# EAGLE design explorer (EAGLE 7.5.0)
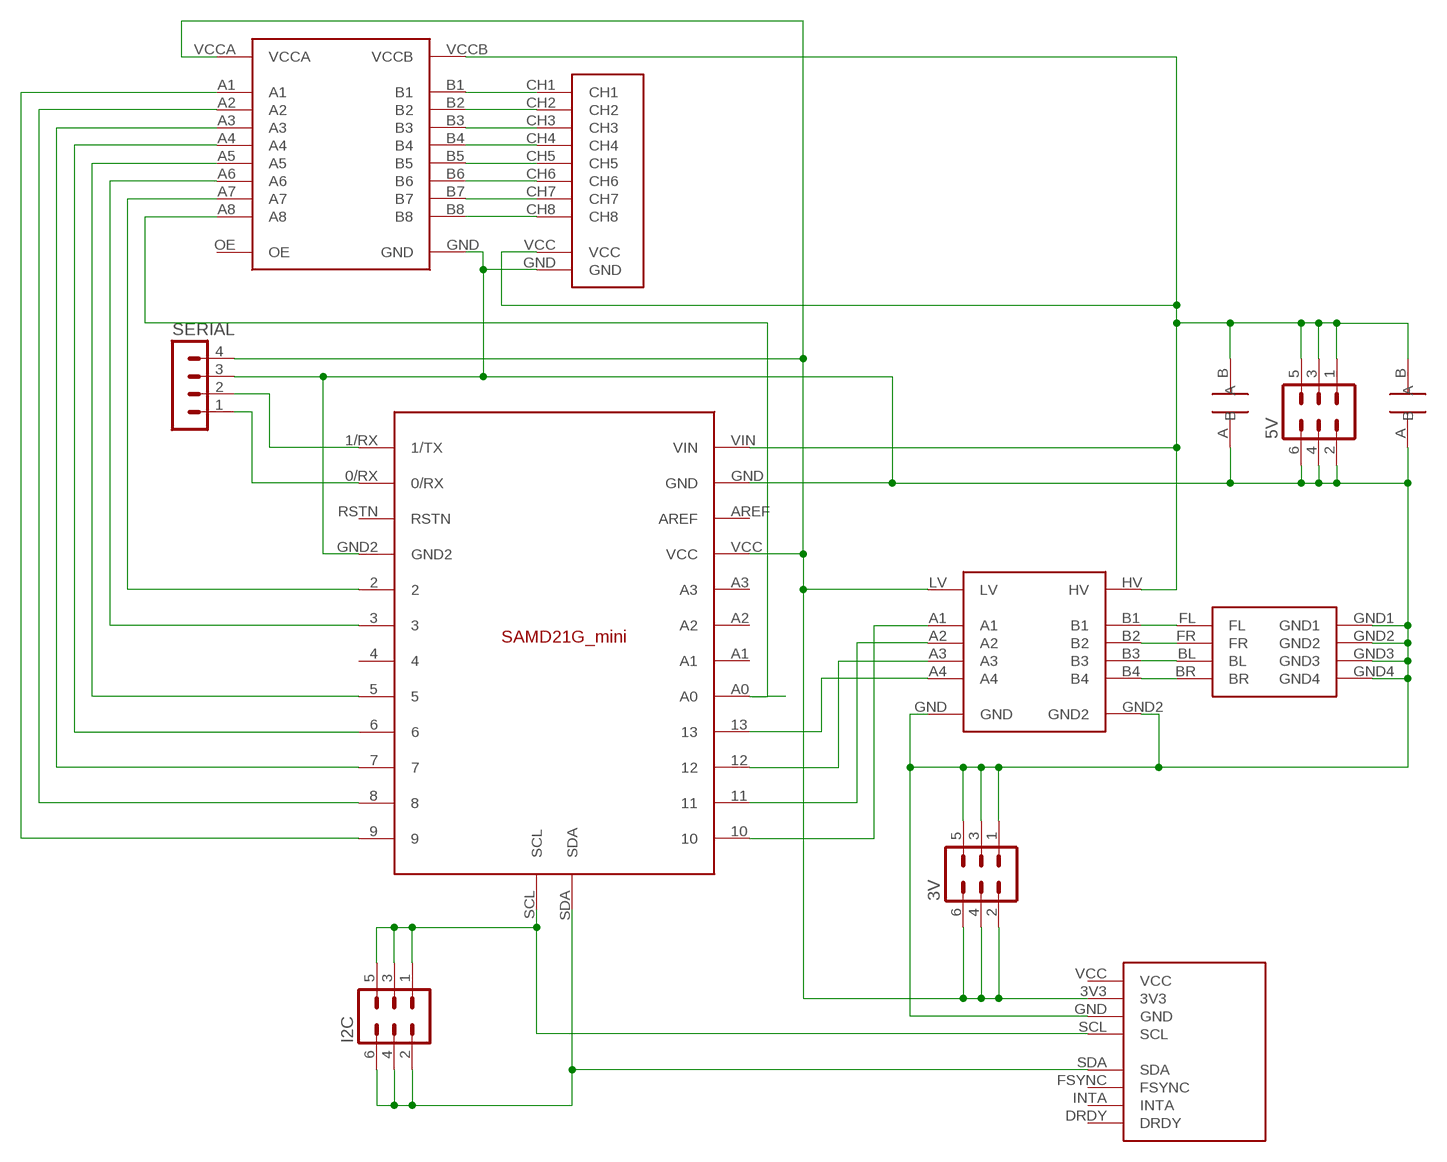
[diagram p0: schematic, sheet 1]

## Parts
3V  MA03-2  [MA03-2]
5V  MA03-2  [MA03-2]
I2C  MA03-2  [MA03-2]
SERIAL  MA04-1  [MA04-1]
U$1  MOTOR_HEADER  [MOTOR_HEADER]
U$2  CAP  [CAP]
U$3  SAMD21G_MINI  [SAMD21G-MINI]
U$4  LEVELSHIFT_8CH  [LEVELSHIFT_8CH]
U$5  LEVELSHIFT_4CH  [LEVELSHIFT_4CH]
U$6  RADIO_8CH  [RADIO_8CH]
U$7  CAP  [CAP]
U$8  GY-86  [GY-86]

## Nets
3V: 3V.2 3V.4 3V.6 SERIAL.4 U$3.VCC U$4.VCCA U$5.LV U$8.3V3
5V: 5V.1 5V.3 5V.5 U$2.B U$3.VIN U$4.VCCB U$5.HV U$6.VCC U$7.B
GND: 3V.1 3V.3 3V.5 5V.2 5V.4 5V.6 SERIAL.3 U$1.GND1 U$1.GND2 U$1.GND3 U$1.GND4 U$2.A U$3.GND U$3.GND2 U$4.GND U$5.GND U$5.GND2 U$6.GND U$7.A U$8.GND
N$1: U$1.BR U$5.B4
N$2: U$1.BL U$5.B3
N$3: U$1.FR U$5.B2
N$4: U$1.FL U$5.B1
N$6: U$3.7 U$4.A3
N$7: U$3.10 U$5.A1
N$8: U$3.11 U$5.A2
N$9: U$3.12 U$5.A3
N$10: U$3.13 U$5.A4
N$11: U$4.B1 U$6.CH1
N$12: U$4.B2 U$6.CH2
N$13: U$4.B3 U$6.CH3
N$14: U$4.B4 U$6.CH4
N$15: U$4.B5 U$6.CH5
N$16: U$4.B6 U$6.CH6
N$17: U$4.B7 U$6.CH7
N$18: U$4.B8 U$6.CH8
N$19: U$3.2 U$4.A7
N$20: U$3.9 U$4.A1
N$21: U$3.8 U$4.A2
N$22: U$3.6 U$4.A4
N$23: U$3.5 U$4.A5
N$24: U$3.3 U$4.A6
N$25: U$3.A0 U$4.A8
N$26: I2C.1 I2C.3 I2C.5 U$3.SCL U$8.SCL
N$28: I2C.2 I2C.4 I2C.6 U$3.SDA U$8.SDA
N$33: SERIAL.1 U$3.0/RX
N$34: SERIAL.2 U$3.1/RX(1/TX)
Unconnected: U$3.4 U$3.A1 U$3.A2 U$3.A3 U$3.AREF U$3.RSTN U$4.OE U$8.DRDY U$8.FSYNC U$8.INTA U$8.VCC

## Library data of the parts
3V 5V I2C = con-lstb:MA03-2: PIN HEADER; OC_FARNELL: unknown; OC_NEWARK: unknown
SERIAL = con-lstb:MA04-1: PIN HEADER; OC_FARNELL: unknown; OC_NEWARK: unknown
U$1 = quadcopter_comp:MOTOR_HEADER
U$2 U$7 = quadcopter_comp:CAP
U$3 = quadcopter_comp:SAMD21G_MINI
U$4 = quadcopter_comp:LEVELSHIFT_8CH
U$5 = quadcopter_comp:LEVELSHIFT_4CH
U$6 = quadcopter_comp:RADIO_8CH
U$8 = quadcopter_comp:GY-86: 10 DoF breakout board. Combined MPU6050, HMC5883L and MS5611

## Board
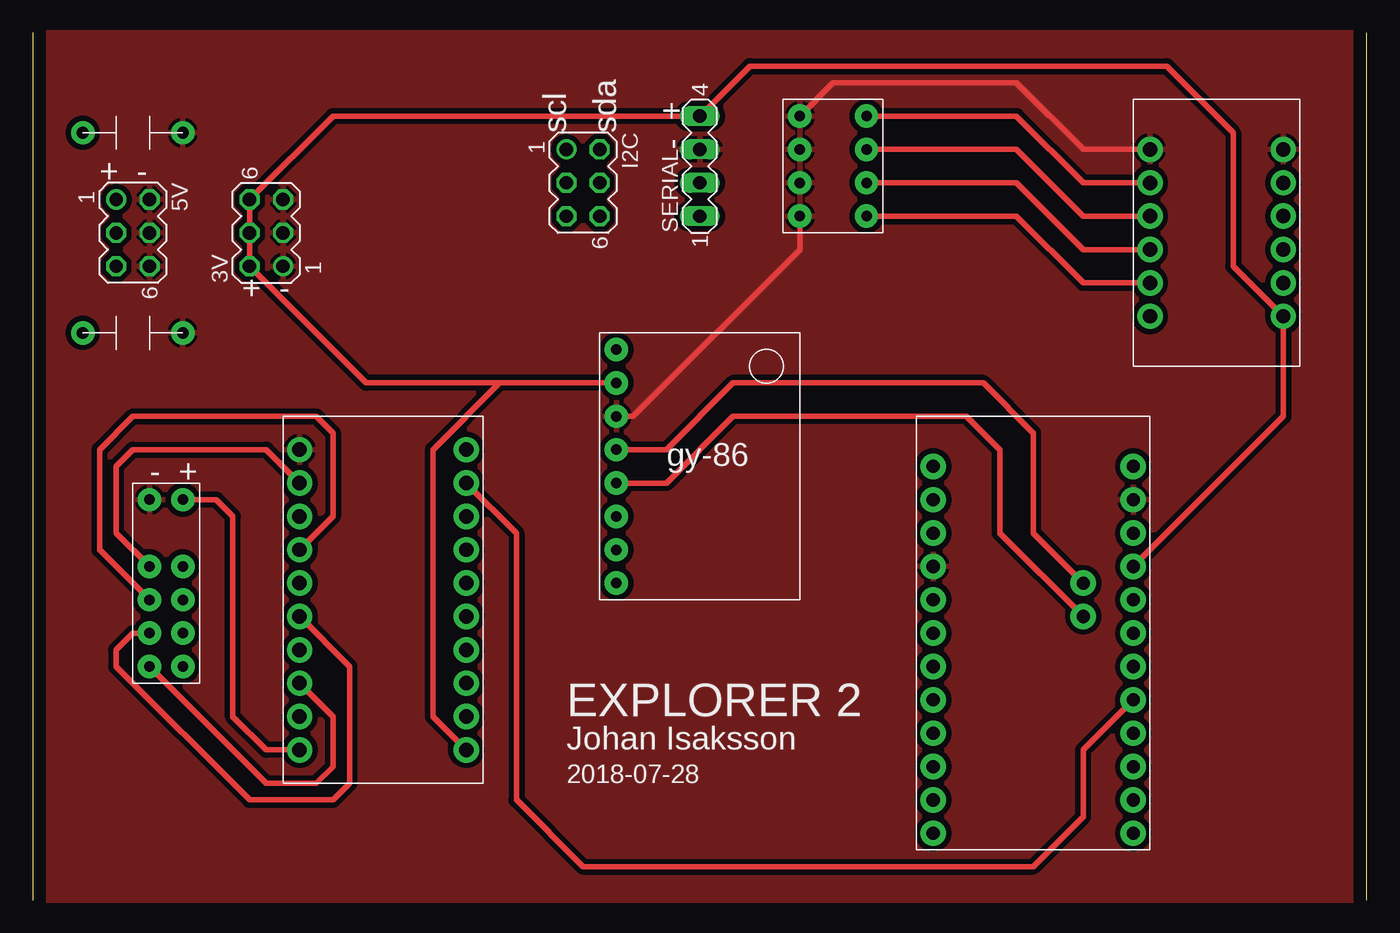
[diagram p1: board, top side]
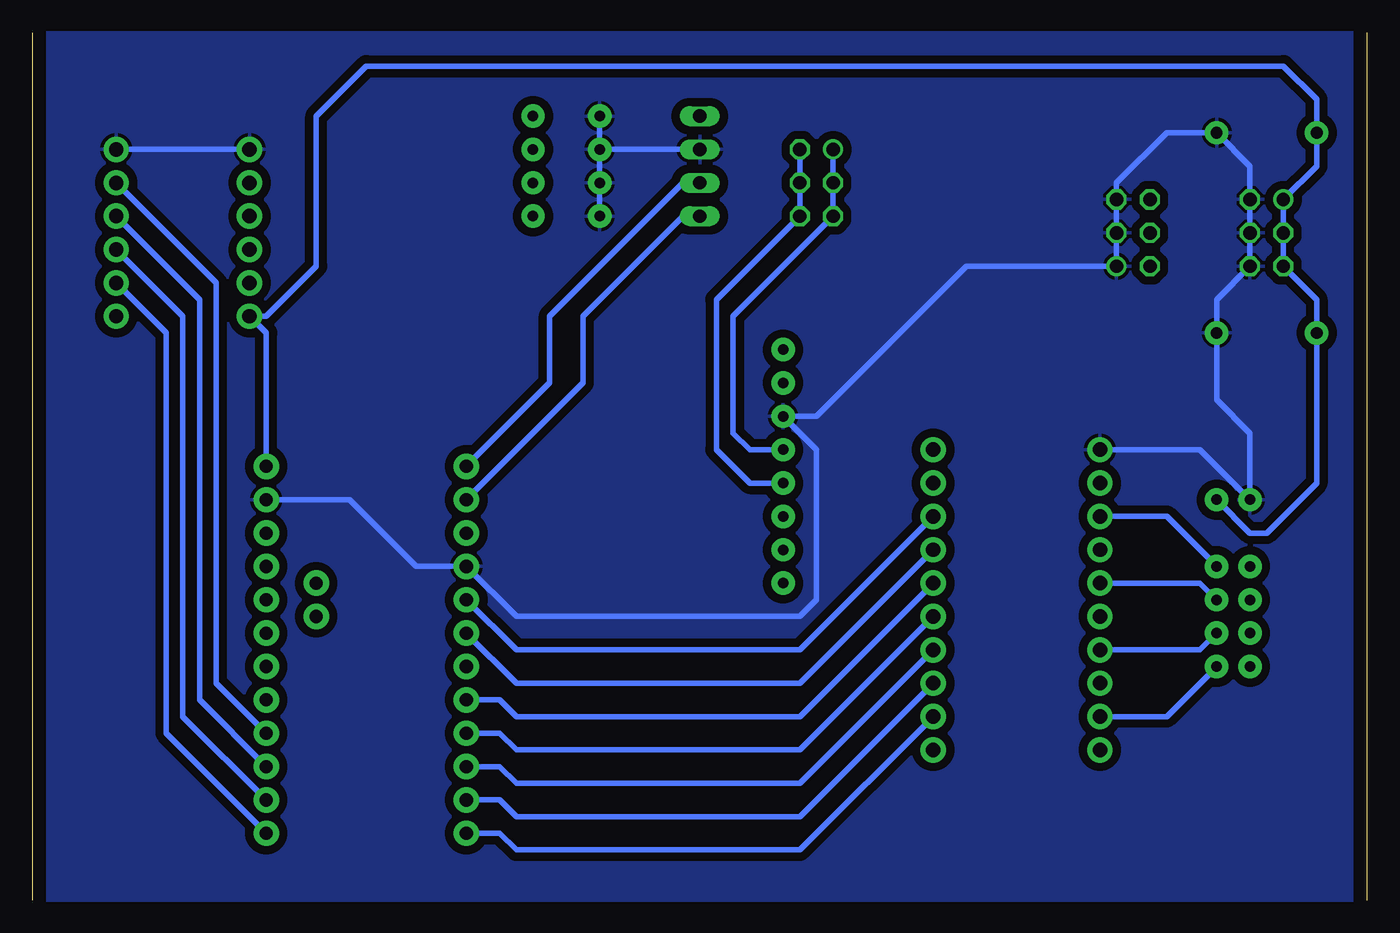
[diagram p2: board, bottom side, seen from below]

Size 101.6 x 66.03 mm. Coordinates in mm from the lower left corner, seen from the top.
Outline: 101.6,0 101.6,66.03
Outline: 0,66.03 0,0
Copper layers (1*16): Top 0.035mm / dielectric 1.5mm / Bottom 0.035mm
Design rules "default *": minimum track width 16mil, minimum drill 24mil, track to track 16mil, track to pad 16mil, pad to pad 16mil, via to via 16mil, smd to smd 8mil, copper to edge 40mil, drill to drill 8mil, minimum pad ring 10mil, minimum via ring 8mil, stop-mask expansion 4mil, vias tented up to drill 0mil, thermal gap 10mil

### Footprints (pad centres in the part's own frame; a part is rotated, then mirrored left to right if it is on the bottom)
MA03-2 = drill 1.016: 1 -2.54,-1.27 | drill 1.016 octagon: 2 -2.54,1.27; 3 0,-1.27; 4 0,1.27; 5 2.54,-1.27; 6 2.54,1.27
MA04-1 = drill 1.016 long: 1 -3.81,0; 2 -1.27,0; 3 1.27,0; 4 3.81,0
MOTOR_HEADER = drill 0.8 pad 1.778: BL -2.54,-1.27; BR -2.54,-3.81; FL -2.54,3.81; FR -2.54,1.27; GND1 2.54,3.81; GND2 2.54,1.27; GND3 2.54,-1.27; GND4 2.54,-3.81
CAP = drill 0.9 pad 1.778: A -3.81,0; B 3.81,0
SAMD21G-MINI = drill 1 pad 1.93: 0/RX -7.62,10.16; 1/RX -7.62,12.7; 2 -7.62,2.54; 3 -7.62,0; 4 -7.62,-2.54; 5 -7.62,-5.08; 6 -7.62,-7.62; 7 -7.62,-10.16; 8 -7.62,-12.7; 9 -7.62,-15.24; 10 7.62,-15.24; 11 7.62,-12.7; 12 7.62,-10.16; 13 7.62,-7.62; A0 7.62,-5.08; A1 7.62,-2.54; A2 7.62,0; A3 7.62,2.54; AREF 7.62,7.62; GND -7.62,5.08; GND2 7.62,10.16; RSTN -7.62,7.62; SCL 3.81,3.81; SDA 3.81,1.27; VCC 7.62,5.08; VIN 7.62,12.7
LEVELSHIFT_8CH = drill 1.1 pad 1.93: A1 -6.35,8.89; A2 -6.35,6.35; A3 -6.35,3.81; A4 -6.35,1.27; A5 -6.35,-1.27; A6 -6.35,-3.81; A7 -6.35,-6.35; A8 -6.35,-8.89; B1 6.35,8.89; B2 6.35,6.35; B3 6.35,3.81; B4 6.35,1.27; B5 6.35,-1.27; B6 6.35,-3.81; B7 6.35,-6.35; B8 6.35,-8.89; GND 6.35,-11.43; OE -6.35,-11.43; VCCA -6.35,11.43; VCCB 6.35,11.43
LEVELSHIFT_4CH = drill 1.1 pad 1.93: A1 -5.08,3.81; A2 -5.08,1.27; A3 -5.08,-1.27; A4 -5.08,-3.81; B1 5.08,3.81; B2 5.08,1.27; B3 5.08,-1.27; B4 5.08,-3.81; GND -5.08,-6.35; GND2 5.08,-6.35; HV 5.08,6.35; LV -5.08,6.35
RADIO_8CH = drill 0.8 pad 1.778: CH1 -1.27,6.35; CH2 1.27,6.35; CH3 -1.27,3.81; CH4 1.27,3.81; CH5 -1.27,1.27; CH6 1.27,1.27; CH7 -1.27,-1.27; CH8 1.27,-1.27; GND 1.27,-6.35; VCC -1.27,-6.35
GY-86 = drill 0.8 pad 1.778: 3V3 -6.35,6.35; DRDY -6.35,-8.89; FSYNC -6.35,-3.81; GND -6.35,3.81; INTA -6.35,-6.35; SCL -6.35,1.27; SDA -6.35,-1.27; VCC -6.35,8.89

### Placement (x,y rotation side)
3V  17.78,50.8 90 top
5V  7.62,50.8 270 top
I2C  41.91,54.61 270 top
SERIAL  50.8,55.88 90 top
U$1  60.96,55.88 180 top
U$2  7.62,43.18 180 top
U$3  76.2,20.32 0 top
U$4  26.67,22.86 180 top
U$5  90.17,50.8 180 top
U$6  10.16,24.13 180 top
U$7  7.62,58.42 180 top
U$8  50.8,33.02 0 top

### Tracks (layer width: path | path; a pad name or v marks a point on that pad's centre or on a via)
3V
  Top 0.406: U$3.VCC 95.25,36.83 U$5.LV 91.44,48.26 91.44,58.42 86.36,63.5 54.61,63.5 SERIAL.4 22.86,59.69 3V.6 3V.4 3V.2 25.4,39.37 35.56,39.37 | U$8.3V3 35.56,39.37 | U$4.VCCA 30.48,13.97 30.48,34.29 35.56,39.37
5V
  Top 0.406: U$6.VCC 13.97,30.48 15.24,29.21 15.24,13.97 17.78,11.43 U$4.VCCB
  Bottom 0.406: U$3.VIN 83.82,43.18 U$5.HV 83.82,44.45 80.01,48.26 80.01,59.69 76.2,63.5 6.35,63.5 3.81,60.96 U$7.B 3.81,55.88 5V.1 5V.3 5V.5 3.81,45.72 U$2.B 3.81,31.75 7.62,27.94 8.89,27.94 U$6.VCC
GND
  Top 0.406: U$5.GND2 80.01,57.15 74.93,62.23 60.96,62.23 U$1.GND4 | U$8.GND 45.72,36.83 58.42,49.53 U$1.GND1
  Bottom 0.406: U$1.GND4 U$1.GND3 | U$1.GND1 U$1.GND2 U$1.GND3 | U$4.GND 12.7,34.29 U$6.GND 8.89,35.56 11.43,38.1 U$2.A 11.43,45.72 5V.6 5V.4 5V.2 8.89,55.88 U$7.A 15.24,58.42 19.05,54.61 3V.5 3V.3 3V.1 30.48,48.26 41.91,36.83 U$8.GND 41.91,34.29 41.91,22.86 43.18,21.59 64.77,21.59 U$3.GND 72.39,25.4 77.47,30.48 U$3.GND2 | SERIAL.3 U$1.GND3 | U$5.GND U$5.GND2
  pour Bottom (isolate 0.635): 0,0 101.6,0 101.6,66.04 0,66.04
  pour Top: 0,66.04 101.6,66.04 101.6,0 0,0
N$1
  Top 0.406: U$1.BR 74.93,59.69 80.01,54.61 U$5.B4
N$2
  Top 0.406: U$1.BL 74.93,57.15 80.01,52.07 U$5.B3
N$3
  Top 0.406: U$1.FR 74.93,54.61 80.01,49.53 U$5.B2
N$4
  Top 0.406: U$1.FL 74.93,52.07 80.01,46.99 U$5.B1
N$6
  Bottom 0.406: U$4.A3 43.18,8.89 64.77,8.89 66.04,10.16 U$3.7
N$7
  Bottom 0.406: U$5.A1 91.44,43.18 91.44,12.7 U$3.10
N$8
  Bottom 0.406: U$5.A2 90.17,44.45 90.17,13.97 U$3.11
N$9
  Bottom 0.406: U$5.A3 88.9,45.72 88.9,15.24 U$3.12
N$10
  Bottom 0.406: U$3.13 87.63,16.51 87.63,46.99 U$5.A4
N$11
  Bottom 0.406: U$6.CH1 15.24,13.97 U$4.B1
N$12
  Top 0.406: U$4.B2 22.86,13.97 22.86,10.16 21.59,8.89 17.78,8.89 U$6.CH2
N$13
  Bottom 0.406: U$4.B3 12.7,19.05 U$6.CH3
N$14
  Top 0.406: U$6.CH4 7.62,20.32 6.35,19.05 6.35,17.78 16.51,7.62 22.86,7.62 24.13,8.89 24.13,17.78 U$4.B4
N$15
  Bottom 0.406: U$6.CH5 12.7,24.13 U$4.B5
N$16
  Top 0.406: U$6.CH6 5.08,26.67 5.08,34.29 7.62,36.83 21.59,36.83 22.86,35.56 22.86,29.21 U$4.B6
N$17
  Bottom 0.406: U$4.B7 15.24,29.21 U$6.CH7
N$18
  Top 0.406: U$6.CH8 6.35,27.94 6.35,33.02 7.62,34.29 17.78,34.29 U$4.B8
N$19
  Bottom 0.406: U$4.A7 43.18,19.05 64.77,19.05 U$3.2
N$20
  Bottom 0.406: U$4.A1 43.18,3.81 64.77,3.81 66.04,5.08 U$3.9
N$21
  Bottom 0.406: U$4.A2 43.18,6.35 64.77,6.35 66.04,7.62 U$3.8
N$22
  Bottom 0.406: U$4.A4 43.18,11.43 64.77,11.43 66.04,12.7 U$3.6
N$23
  Bottom 0.406: U$4.A5 43.18,13.97 64.77,13.97 66.04,15.24 U$3.5
N$24
  Bottom 0.406: U$4.A6 43.18,16.51 64.77,16.51 U$3.3
N$25
  Top 0.406: U$4.A8 36.83,27.94 36.83,7.62 41.91,2.54 76.2,2.54 80.01,6.35 80.01,11.43 U$3.A0
N$26
  Top 0.406: U$3.SCL 76.2,27.94 76.2,35.56 72.39,39.37 53.34,39.37 48.26,34.29 U$8.SCL
  Bottom 0.406: I2C.1 I2C.3 I2C.5 48.26,44.45 48.26,35.56 46.99,34.29 U$8.SCL
N$28
  Top 0.406: U$3.SDA 73.66,27.94 73.66,34.29 71.12,36.83 53.34,36.83 48.26,31.75 U$8.SDA
  Bottom 0.406: I2C.2 I2C.4 I2C.6 49.53,45.72 49.53,34.29 46.99,31.75 U$8.SDA
N$33
  Bottom 0.406: U$3.0/RX 59.69,39.37 59.69,44.45 52.07,52.07 SERIAL.1
N$34
  Bottom 0.406: U$3.1/RX 62.23,39.37 62.23,44.45 52.07,54.61 SERIAL.2

### Text on the board
tNames: scl | sda | - + | + - | + - | gy-86 | - + | Johan Isaksson | EXPLORER 2 | 2018-07-28